# EAGLE design 89c2051-xdb-ps2 (EAGLE 4.16)
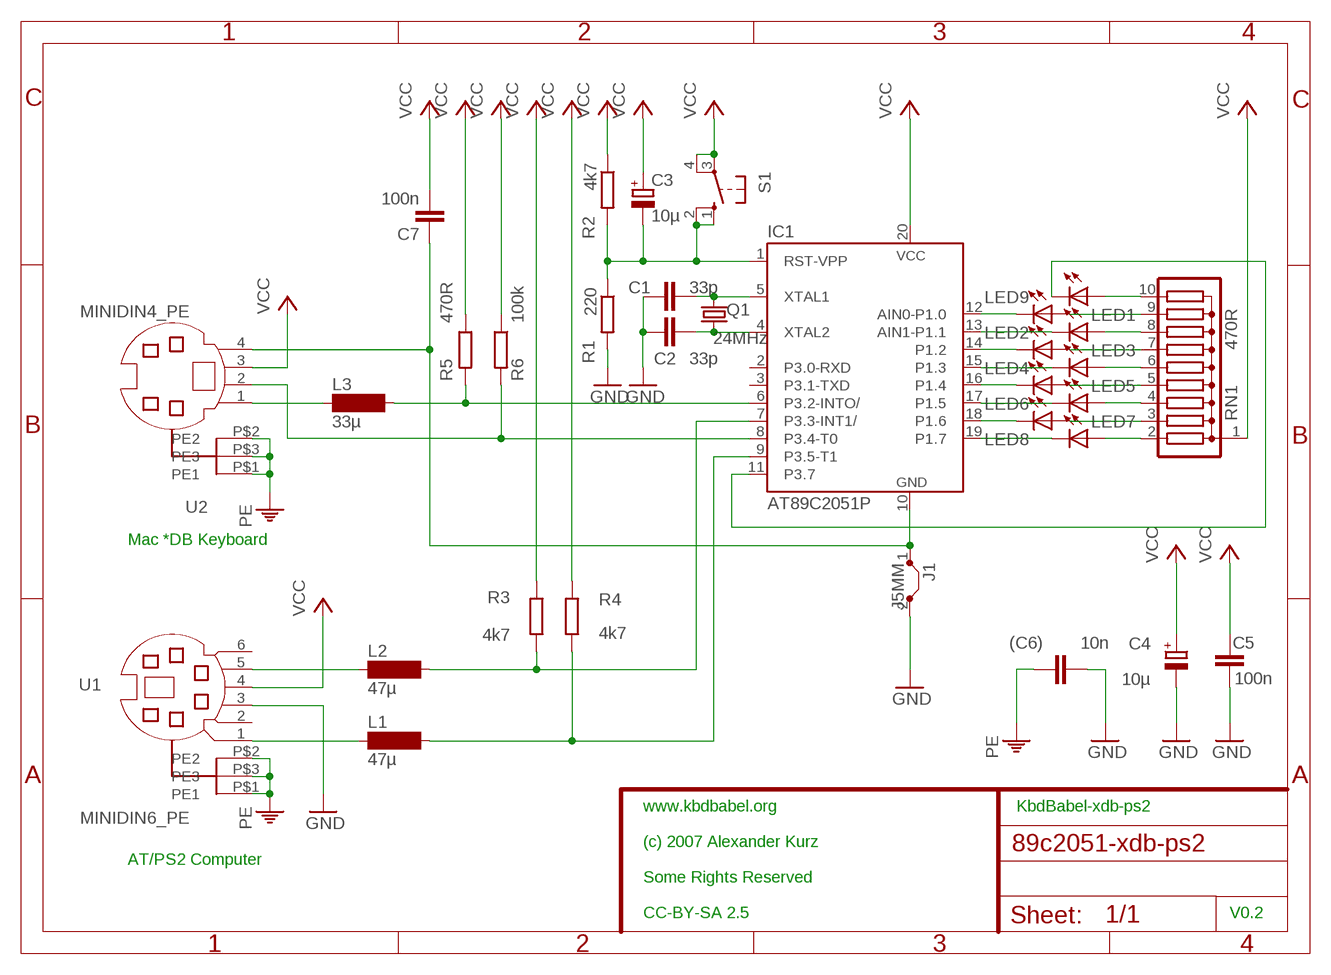
[diagram p0: schematic, sheet 1]

## Parts
(C6)  10n  C-EU025_050-025X075  [C025_050-025X075]
C1  33p  C-EU025-030X050  [C025-030X050]
C2  33p  C-EU025-030X050  [C025-030X050]
C3  10µ  CPOL-EUE2-5  [E2-5]
C4  10µ  CPOL-EUE2-5  [E2-5]
C5  100n  C-EU025_050-025X075  [C025_050-025X075]
C7  100n  C-EU025_050-025X075  [C025_050-025X075]
IC1  AT89C2051P  [DIL20]
J1  J5MM  [05]
L1  47µ  SD75  [SD75]
L2  47µ  SD75  [SD75]
L3  33µ  SD75  [SD75]
LED1  LEDSQR2X5  [LED2X5]
LED2  LEDSQR2X5  [LED2X5]
LED3  LEDSQR2X5  [LED2X5]
LED4  LEDSQR2X5  [LED2X5]
LED5  LEDSQR2X5  [LED2X5]
LED6  LEDSQR2X5  [LED2X5]
LED7  LEDSQR2X5  [LED2X5]
LED8  LEDSQR2X5  [LED2X5]
LED9  LEDSQR2X5  [LED2X5]
Q1  24MHz  CRYSTALHC49U70  [HC49U70]
R1  220  R-EU_0204/7  [0204/7]
R2  4k7  R-EU_0204/7  [0204/7]
R3  4k7  R-EU_0204/5  [0204/5]
R4  4k7  R-EU_0204/5  [0204/5]
R5  470R  R-EU_0204/7  [0204/7]
R6  100k  R-EU_0204/7  [0204/7]
RN1  470R  G09R  [SIL10]
S1  10-XX  [B3F-10XX]
U1  MINIDIN6_PE  [MINIDIN6_PE]
U2  MINIDIN4_PE  [MINIDIN4_PE]

## Nets
GND: (C6).2 C1.1 C2.2 C4.- C5.1 J1.2 R1.2 U1.3
N$1: C1.2 IC1.5(XTAL1) Q1.2
N$2: C2.1 IC1.4(XTAL2) Q1.1
N$3: L3.1 U2.1
N$4: LED1.A RN1.9
N$5: IC1.17(P1.5) LED6.K(C)
N$6: L2.1 U1.5
N$7: IC1.6(P3.2-INTO/) L3.2 R5.2
N$8: IC1.12(AIN0-P1.0) LED1.K(C)
N$9: C3.- IC1.1(RST-VPP) R1.1 R2.2 S1.1(S) S1.2(S1)
N$10: IC1.8(P3.4-T0) R6.2 U2.2
N$11: IC1.7(P3.3-INT1/) L2.2 R3.2
N$12: IC1.9(P3.5-T1) L1.2 R4.2
N$13: IC1.13(AIN1-P1.1) LED2.K(C)
N$14: LED3.A RN1.7
N$15: IC1.15(P1.3) LED4.K(C)
N$16: LED5.A RN1.5
N$17: LED2.A RN1.8
N$18: LED4.A RN1.6
N$19: LED6.A RN1.4
N$20: IC1.18(P1.6) LED7.K(C)
N$21: LED8.A RN1.2
N$22: LED7.A RN1.3
N$23: IC1.19(P1.7) LED8.K(C)
N$24: IC1.16(P1.4) LED5.K(C)
N$25: IC1.14(P1.2) LED3.K(C)
N$26: L1.1 U1.1
N$27: LED9.A RN1.10
N$28: IC1.11(P3.7) LED9.K(C)
N$29: C7.1 IC1.10(GND) J1.1 U2.4
PE: (C6).1 U1.P$1(PE1) U1.P$2(PE2) U1.P$3(PE3) U2.P$1(PE1) U2.P$2(PE2) U2.P$3(PE3)
VCC: C3.+ C4.+ C5.2 C7.2 IC1.20(VCC) R2.1 R3.1 R4.1 R5.1 R6.1 RN1.1 S1.3(P) S1.4(P1) U1.4 U2.3
Unconnected: IC1.2(P3.0-RXD) IC1.3(P3.1-TXD) U1.2 U1.6

## Notes on the sheet
- Mac *DB Keyboard
- www.kbdbabel.org | KbdBabel-xdb-ps2
- (c) 2007 Alexander Kurz
- AT/PS2 Computer
- Some Rights Reserved
- CC-BY-SA 2.5 | V0.2

## Library data of the parts
(C6) C1 C2 C5 C7 = rcl:C-EU: CAPACITOR, European symbol
C3 C4 = rcl:CPOL-EU: POLARIZED CAPACITOR, European symbol
IC1 = atmel:AT89C2051: 80C31 MICROCONTROLLER 2 Kbytes FLASH 2.7 V
J1 = jumper:J: Bridge
L1-L3 = inductor-neosid:SD75: INDUCTOR nominal inductance, E12
LED1-LED9 = led:LED: LED OSRAM: - CHIPLED LG R971, LG N971, LY N971, LG Q971, LY Q971, LO R971, LY R971 LH N974, LH R974 LS Q976, LO Q976, LY Q976 LO Q996 - Hyper CHIPLED LW Q18S LB Q993, LB Q99A, LB R99A - SideLED LS A670, LO A670, LY A670, LG A670, LP A670 LB A673, LV A673, LT A673, LW A673 LH A674 LY A675 LS A676, LA A676, LO A676, LY A676, LW A676 LS A679, LY A679, LG A679 - Hyper Micro SIDELED® LS Y876, LA Y876, LO Y876, LY Y876 LT Y87S - SmartLED LW L88C, LW L88S LB L89C, LB L89S, LG L890 LS L89K, LO L89K, LY L89K LS L896, LA L896, LO L896, LY L896 - TOPLED LS T670, LO T670, LY T670, LG T670, LP T670 LSG T670, LSP T670, LSY T670, LOP T670, LYG T670 LG T671, LOG T671, LSG T671 LB T673, LV T673, LT T673, LW T673 LH T674 LS T676, LA T676, LO T676, LY T676, LB T676, LH T676, LSB T676, LW T676 LB T67C, LV T67C, LT T67C, LS T67K, LO T67K, LY T67K, LW E67C LS E67B, LA E67B, LO E67B, LY E67B, LB E67C, LV E67C, LT E67C LW T67C LS T679, LY T679, LG T679 LS T770, LO T770, LY T770, LG T770, LP T770 LB T773, LV T773, LT T773, LW T773 LH T774 LS E675, LA E675, LY E675, LS T675 LS T776, LA T776, LO T776, LY T776, LB T776 LHGB T686 LT T68C, LB T68C - Hyper Mini TOPLED® LB M676 - Mini TOPLED Santana® LG M470 LS M47K, LO M47K, LY M47K Source: http://www.osram.convergy.de - LUMILED® LXK2-PW12-R00, LXK2-PW12-S00, LXK2-PW14-U00, LXK2-PW14-V00 LXK2-PM12-R00, LXK2-PM12-S00, LXK2-PM14-U00 LXK2-PE12-Q00, LXK2-PE12-R00, LXK2-PE12-S00, LXK2-PE14-T00, LXK2-PE14-U00 LXK2-PB12-K00, LXK2-PB12-L00, LXK2-PB12-M00, LXK2-PB14-N00, LXK2-PB14-P00, LXK2-PB14-Q00 LXK2-PR12-L00, LXK2-PR12-M00, LXK2-PR14-Q00, LXK2-PR14-R00 LXK2-PD12-Q00, LXK2-PD12-R00, LXK2-PD12-S00 LXK2-PH12-R00, LXK2-PH12-S00 LXK2-PL12-P00, LXK2-PL12-Q00, LXK2-PL12-R00 Source: www.luxeon.com
Q1 = crystal:CRYSTAL: CRYSTAL
R1-R6 = rcl:R-EU_: RESISTOR, European symbol
RN1 = resistor-sil:G09R: SIL RESISTOR
S1 = switch-omron:10-XX: OMRON SWITCH
U1 = bla:MINIDIN6_PE
U2 = bla:MINIDIN4_PE

## Board
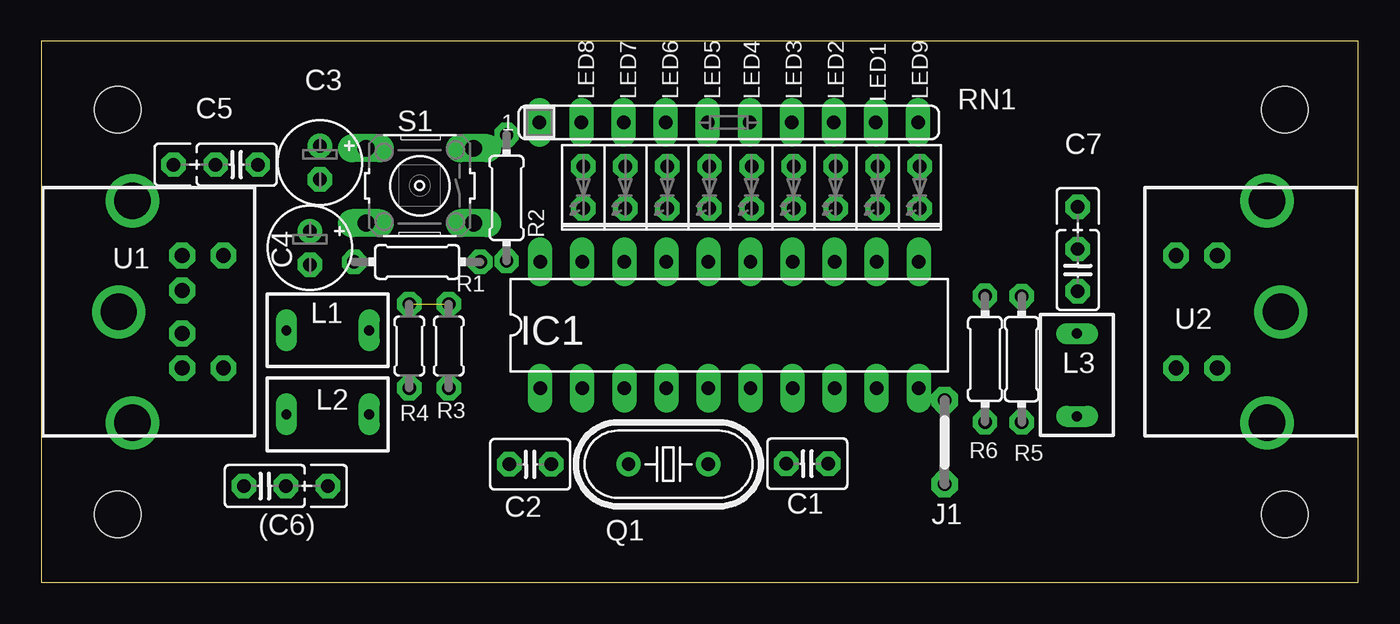
[diagram p1: board, top side]
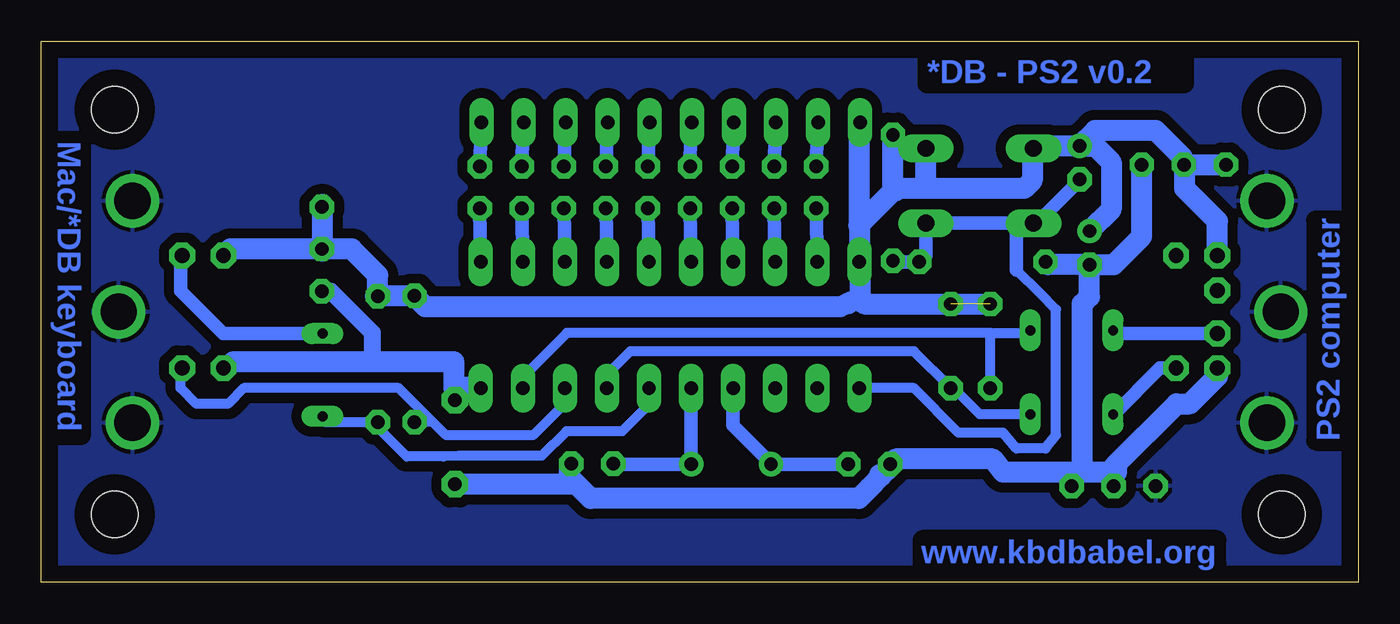
[diagram p2: board, bottom side, seen from below]

Size 79.52 x 32.69 mm. Coordinates in mm from the lower left corner, seen from the top.
Outline: 79.52,0 79.52,32.69 0,32.69 0,0 79.52,0
Copper layers (1*16): Top 0.035mm / dielectric 1.5mm / Bottom 0.035mm
Design rules "default": minimum track width 16mil, minimum drill 24mil, track to track 16mil, track to pad 16mil, pad to pad 16mil, via to via 16mil, smd to smd 16mil, copper to edge 40mil, drill to drill 8mil, minimum pad ring 13mil, minimum via ring 8mil, stop-mask expansion 4mil, vias tented up to drill 0mil, thermal gap 10mil
Holes 2.8 mm at 75.08,4.12 75.08,28.57 4.6,28.57 4.6,4.12

### Footprints (pad centres in the part's own frame; a part is rotated, then mirrored left to right if it is on the bottom)
C025_050-025X075 = drill 0.813 octagon: 1 -1.27,0; 2 1.27,0; 3 3.81,0
C025-030X050 = drill 0.813 octagon: 1 -1.27,0; 2 1.27,0
E2-5 = drill 0.813 pad 1.27 round: + -1.016,0 | drill 0.813 pad 1.27 octagon: - 1.016,0
DIL20 = drill 0.813 long: 1 -11.43,-3.81; 2 -8.89,-3.81; 3 -6.35,-3.81; 4 -3.81,-3.81; 5 -1.27,-3.81; 6 1.27,-3.81; 7 3.81,-3.81; 8 6.35,-3.81; 9 8.89,-3.81; 10 11.43,-3.81; 11 11.43,3.81; 12 8.89,3.81; 13 6.35,3.81; 14 3.81,3.81; 15 1.27,3.81; 16 -1.27,3.81; 17 -3.81,3.81; 18 -6.35,3.81; 19 -8.89,3.81; 20 -11.43,3.81
05 = drill 0.813 pad 1.6 octagon: 1 -2.54,0; 2 2.54,0
SD75 = drill 0.6 long: 1 -2.5,0; 2 2.5,0
LED2X5 = drill 0.813 octagon: A -1.27,0; K 1.27,0
HC49U70 = drill 0.813 round: 1 -2.413,0; 2 2.413,0
0204/7 = drill 0.813 octagon: 1 -3.81,0; 2 3.81,0
0204/5 = drill 0.813 octagon: 1 -2.54,0; 2 2.54,0
SIL10 = drill 0.813 long: 1 -11.43,0; 2 -8.89,0; 3 -6.35,0; 4 -3.81,0; 5 -1.27,0; 6 1.27,0; 7 3.81,0; 8 6.35,0; 9 8.89,0; 10 11.43,0
B3F-10XX = drill 1.016 long: 1 -3.251,2.261; 2 3.251,2.261; 3 -3.251,-2.261; 4 3.251,-2.261
MINIDIN6_PE = drill 0.9 octagon: 1 1.3,2.15; 2 -1.3,2.15; 3 3.4,2.15; 4 -3.4,2.15; 5 3.4,4.65; 6 -3.4,4.65 | drill 2.2 round: P$1 0,-1.676; P$2 -6.706,-0.838; P$3 6.706,-0.838
MINIDIN4_PE = drill 0.9 octagon: 1 3.4,2.15; 2 -3.4,2.15; 3 3.4,4.65; 4 -3.4,4.65 | drill 2.2 round: P$1 0,-1.676; P$2 -6.706,-0.838; P$3 6.706,-0.838

### Placement (x,y rotation side)
(C6)  13.49,5.82 0 top
C1  46.25,7.17 180 top
C2  29.52,7.14 180 top
C3  16.82,25.36 270 top
C4  16.22,20.21 270 top
C5  11.79,25.24 180 top
C7  62.59,18.87 90 top
IC1  41.56,15.55 0 top
J1  54.54,8.47 270 top
L1  17.3,15.23 0 top
L2  17.3,10.15 0 top
L3  62.54,12.54 270 top
LED1  50.51,23.87 270 top
LED2  47.97,23.87 270 top
LED3  45.43,23.87 270 top
LED4  42.89,23.87 270 top
LED5  40.35,23.87 270 top
LED6  37.81,23.87 270 top
LED7  35.27,23.87 270 top
LED8  32.73,23.87 270 top
LED9  53.05,23.87 270 top
Q1  37.87,7.14 0 top
R1  22.7,19.36 180 top
R2  28.09,23.23 270 top
R3  24.6,14.28 270 top
R4  22.22,14.28 270 top
R5  59.21,13.49 270 top
R6  56.99,13.5 270 top
RN1  41.51,27.79 0 top
S1  22.85,23.96 180 top
U1  6.34,16.34 270 top
U2  73.18,16.34 90 top

### Tracks (layer width: path | path; a pad name or v marks a point on that pad's centre or on a via)
GND
  Bottom 1.27: C2.2 28.25,6.98 28.81,6.42 | 28.81,6.42 29.52,5.71 | 29.52,5.71 30.16,5.07 46.35,5.07 47.14,5.87 | 47.14,5.87 47.62,6.34 47.62,7.14 47.52,7.23 | 47.52,7.23 47.46,7.3 | 47.52,7.23 C1.1 | C2.2 | 28.81,6.42 28.89,6.5 | 28.81,6.42 | 47.14,5.87 | J1.2 47.21,5.93 47.14,5.87 | C5.1 13.06,20.9 14.76,19.2 16.19,19.2 C4.- | C4.- 16.22,17.27 16.66,16.82 16.66,6.66 | R1.2 | C4.- 18.72,19.2 R1.2 | 29.52,5.71 29.41,5.82 | U1.3 8.49,12.45 10.15,10.79 10.95,10.79 14.68,7.06 | 14.68,7.06 14.76,6.98 14.76,5.87 14.76,5.86 (C6).2 | 14.68,7.06 14.6,6.98 14.6,6.66 16.66,6.66 | 16.66,6.66 21.43,6.66 22.06,7.45 27.93,7.45 C2.2 | C2.2 | C2.2 28.41,6.98 | C2.2
N$1
  Bottom 0.813: IC1.5 40.29,7.17 40.32,7.14 Q1.2 44.92,7.14 44.95,7.17 C1.2
N$2
  Bottom 0.813: IC1.4 37.75,9.49 35.4,7.14 Q1.1 C2.1
N$3
  Bottom 0.813: U2.1 71.05,19.74 71.11,19.68 71.11,17.61 68.53,15.03 L3.1
N$4
  Bottom 0.813: LED1.A RN1.9
N$5
  Bottom 0.813: IC1.17 LED6.K
N$6
  Bottom 0.813: L2.1 14.76,10.15 11.97,12.94 U1.5
N$7
  Bottom 0.61: IC1.6 42.83,10.76 44.44,9.14 47.81,9.14 49.3,7.65 54.32,7.65 55.24,7.61 57.46,7.61 59.21,9.36 R5.2 62.38,9.68 62.7,9.99 62.66,10.03 L3.2
N$8
  Bottom 0.813: IC1.12 LED1.K
N$9
  Bottom 0.61: 20.63,18.88 19.2,17.46 18.25,16.5 18.25,8.88 18.89,8.09 20.63,8.09 21.43,9.04 24.12,9.04 26.82,11.74 30,11.74 30.13,11.61 | 30.13,11.61 30.16,11.58 | 30.13,11.61 IC1.1
  Bottom 0.813: 20.63,21.7 S1.2 19.4,21.7 16.82,24.28 | 20.63,21.7 25.99,21.7 26.03,21.74 26.07,21.7 S1.1 26.11,19.76 R1.1 | R1.1 | R2.2 28.09,19.36 R1.1 | 16.82,24.28 | 16.82,24.28 C3.- | 20.63,21.7 20.63,21.74 | 20.63,18.88 20.63,21.7
N$10
  Bottom 0.61: IC1.8 47.91,10.82 49.84,8.88 55.08,8.88 55.89,9.69 | 55.89,9.69 56.03,9.84 | 55.89,9.69 R6.2 | 55.89,9.69 57.94,11.74 67.3,11.74 68.26,10.79 70.16,10.79 71.11,11.74 71.11,13.01 71.05,12.94 U2.2
N$11
  Bottom 0.61: IC1.7 45.37,11.87 45.4,11.9 45.4,12.53 43.97,13.96 26.82,13.96 R3.2 | 24.6,11.9 | 24.6,11.9 R3.2 | L2.2 22.85,10.15 24.6,11.9 | R3.2
N$12
  Bottom 0.61: IC1.9 50.45,12.41 47.78,15.07 22.22,15.07 | L1.2 19.84,15.23 19.84,15.07 22.22,15.07 | R4.2 22.22,15.07
N$13
  Bottom 0.813: IC1.13 LED2.K
N$14
  Bottom 0.813: LED3.A RN1.7
N$15
  Bottom 0.813: IC1.15 LED4.K
N$16
  Bottom 0.813: LED5.A 40.32,26.95 RN1.5
N$17
  Bottom 0.813: LED2.A RN1.8
N$18
  Bottom 0.406: LED4.A RN1.6
  Bottom 0.813: LED4.A RN1.6
N$19
  Bottom 0.406: LED6.A RN1.4
  Bottom 0.813: LED6.A RN1.4
N$20
  Bottom 0.813: IC1.18 LED7.K
N$21
  Bottom 0.813: LED8.A RN1.2
N$22
  Bottom 0.813: LED7.A RN1.3
N$23
  Bottom 0.813: IC1.19 LED8.K
N$24
  Bottom 0.813: IC1.16 LED5.K
N$25
  Bottom 0.813: IC1.14 LED3.K
N$26
  Bottom 0.813: L1.1 14.92,15.23 14.73,15.04 U1.1
N$27
  Bottom 0.813: LED9.A RN1.10
N$28
  Bottom 0.813: IC1.11 LED9.K
N$29
  Bottom 1.016: C7.1 62.05,17.6 59.53,15.07 59.53,13.33
  Bottom 1.27: U2.4 68.32,12.94 67.94,13.33 59.53,13.33 54.6,13.33 54.6,11.74 | 54.6,11.01 54.6,10.95 | 54.6,11.01 J1.1 | 54.6,11.74 54.6,11.01 | 52.99,11.77 54.6,11.77 54.6,11.74 | IC1.10 53.02,11.74 52.99,11.77 | 52.99,11.77
PE
  pour Bottom (isolate 0.61): 79.67,-0.13 79.64,32.85 -0.18,32.85 -0.14,-0.1
VCC  (1 unrouted)
  Bottom 1.27: 30.17,17.17 30.09,17.2 IC1.20 30.13,21.58 | 30.17,17.17 30.81,16.87 | 30.81,16.87 31.29,16.64 56.33,16.64 56.99,17.3 R6.1 59.35,17.31 59.37,17.3 R5.1 59.21,18.57 | 30.13,21.58 30.13,27.74 30.16,27.77 30.14,27.79 RN1.1 | 19.52,26.19 19.56,26.23 S1.4 19.6,26.27 19.68,26.35 | 68.53,19.72 68.57,19.68 | 68.53,19.72 U2.3 | C7.2 68.11,20.14 68.53,19.72 | C7.2 60.78,20.14 59.21,18.57 | 59.21,18.57 | 62.54,20.15 62.54,20 | 62.54,20.15 62.54,22.85 | U1.4 8.49,21.83 10.47,23.81 10.47,25.23 | 10.47,25.23 7.93,25.23 | 16.82,26.35 15.87,27.3 12.22,27.3 10.63,25.71 10.63,25.23 10.47,25.23 | 16.82,26.35 C3.+ | 16.82,26.35 19.68,26.35 | 16.82,26.35 15.87,26.35 14.92,25.39 14.92,22.54 C4.+ | 30.79,16.82 30.81,16.84 30.81,16.87 | 30.79,16.82 | 10.47,25.23 10.48,25.24 C5.2 | C7.2 62.55,20.14 62.54,20.15 | 30.17,17.17 30.17,17.15 29.84,16.82 R4.1 | 19.68,26.35 19.68,24.28 20.16,23.81 26.03,23.81 | 30.13,21.58 30.16,21.58 28.01,23.73 | 26.03,23.81 27.93,23.81 28.01,23.73 | 28.09,27.14 R2.1 28.09,23.81 28.01,23.73 | S1.3 26.11,23.88 26.03,23.81 | 28.01,23.73 27.93,23.65 | 28.01,23.73

### Text on the board
Bottom: *DB - PS2 v0.2 | Mac/*DB keyboard | PS2 computer | www.kbdbabel.org